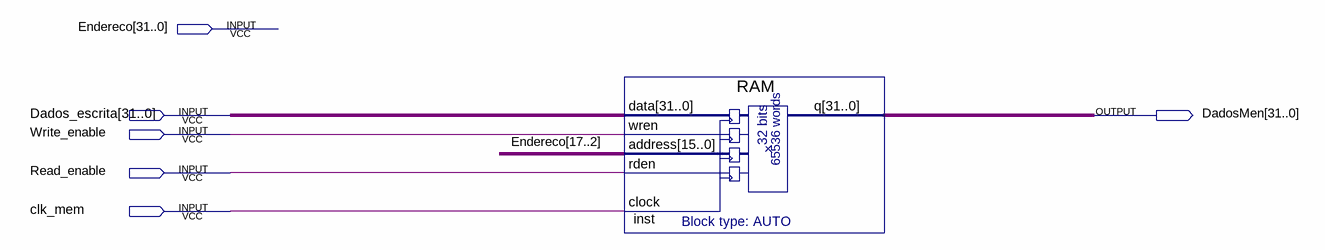
[diagram p0: schematic sheet]
// Quartus schematic Memoria.bdf as structural Verilog: 1 symbols, 6 pins
module Memoria (
  input  [31:0] Endereco,
  input  [31:0] Dados_escrita,
  input  Write_enable,
  input  Read_enable,
  input  clk_mem,
  output [31:0] DadosMen
);

  RAM inst (
    .data(Dados_escrita), .wren(Write_enable), .address(Endereco[17:2]), .rden(Read_enable), .clock(clk_mem),
    .q(DadosMen));
endmodule
